# EAGLE schematic higheTemp (EAGLE 9.5.2)
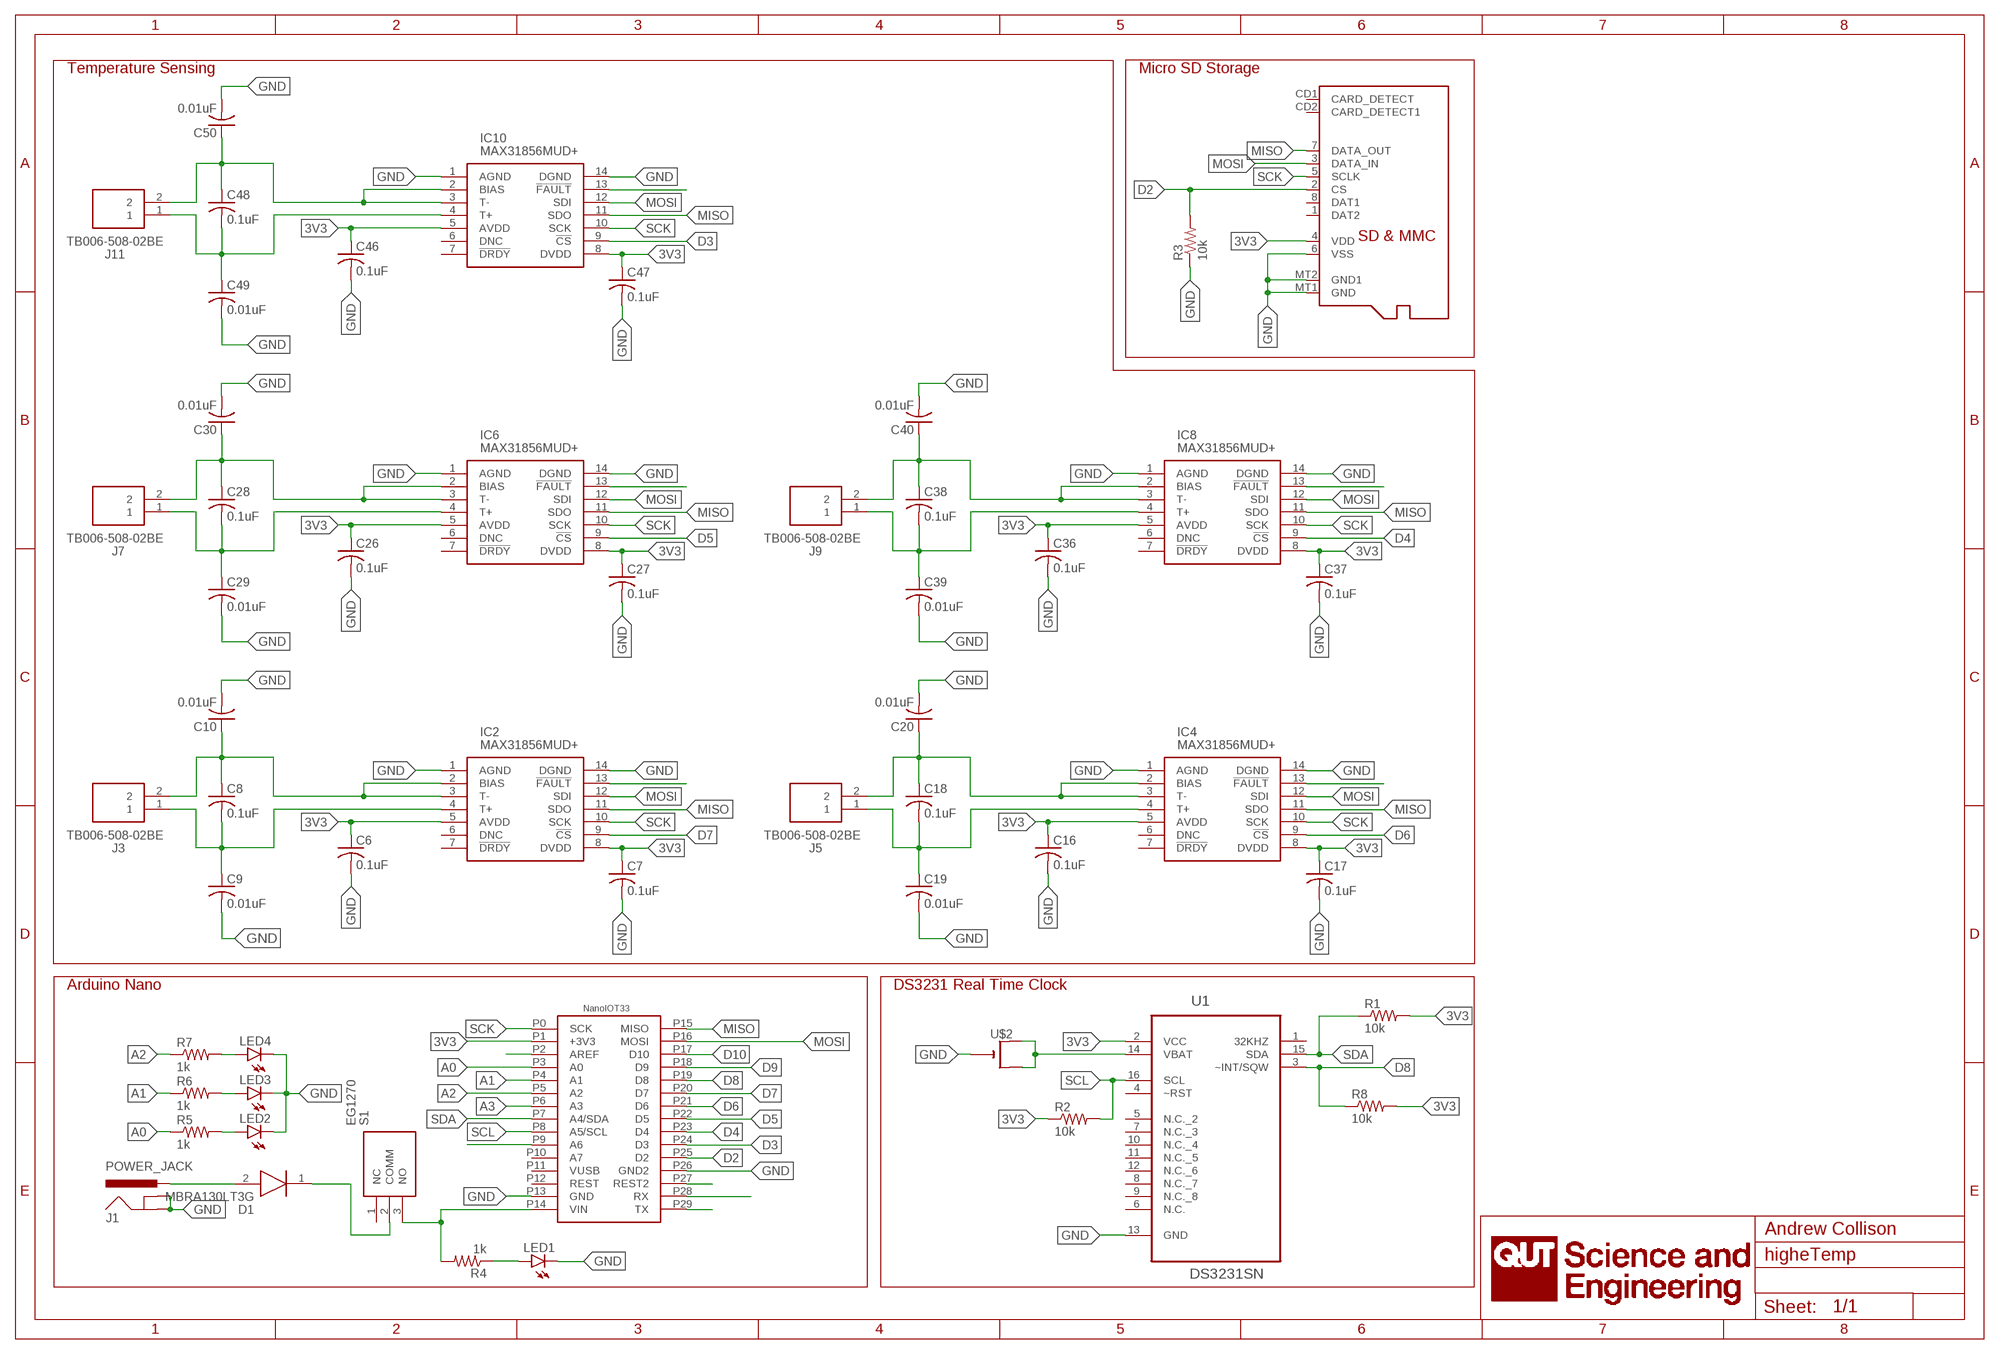
[diagram p0: schematic, sheet 1]

## Parts
C6  0.1uF  C-USC0603  [C0603]
C7  0.1uF  C-USC0603  [C0603]
C8  0.1uF  C-USC0603  [C0603]
C9  0.01uF  C-USC0603  [C0603]
C10  0.01uF  C-USC0603  [C0603]
C16  0.1uF  C-USC0603  [C0603]
C17  0.1uF  C-USC0603  [C0603]
C18  0.1uF  C-USC0603  [C0603]
C19  0.01uF  C-USC0603  [C0603]
C20  0.01uF  C-USC0603  [C0603]
C26  0.1uF  C-USC0603  [C0603]
C27  0.1uF  C-USC0603  [C0603]
C28  0.1uF  C-USC0603  [C0603]
C29  0.01uF  C-USC0603  [C0603]
C30  0.01uF  C-USC0603  [C0603]
C36  0.1uF  C-USC0603  [C0603]
C37  0.1uF  C-USC0603  [C0603]
C38  0.1uF  C-USC0603  [C0603]
C39  0.01uF  C-USC0603  [C0603]
C40  0.01uF  C-USC0603  [C0603]
C46  0.1uF  C-USC0603  [C0603]
C47  0.1uF  C-USC0603  [C0603]
C48  0.1uF  C-USC0603  [C0603]
C49  0.01uF  C-USC0603  [C0603]
C50  0.01uF  C-USC0603  [C0603]
D1  MBRA130LT3G  [DIOM5226X220N]
IC2  MAX31856MUD+  [SOP65P640X110-14N]
IC4  MAX31856MUD+  [SOP65P640X110-14N]
IC6  MAX31856MUD+  [SOP65P640X110-14N]
IC8  MAX31856MUD+  [SOP65P640X110-14N]
IC10  MAX31856MUD+  [SOP65P640X110-14N]
J1  POWER_JACK  [POWER_JACK_PTH]
J3  TB006-508-02BE  [TB00650802BE]
J5  TB006-508-02BE  [TB00650802BE]
J7  TB006-508-02BE  [TB00650802BE]
J9  TB006-508-02BE  [TB00650802BE]
J11  TB006-508-02BE  [TB00650802BE]
LED1  LEDCHIPLED_0805  [CHIPLED_0805]
LED2  LEDCHIPLED_0805  [CHIPLED_0805]
LED3  LEDCHIPLED_0805  [CHIPLED_0805]
LED4  LEDCHIPLED_0805  [CHIPLED_0805]
R1  10k  R-US_R0603  [R0603]
R2  10k  R-US_R0603  [R0603]
R3  10k  R-US_R0805  [R0805]
R4  1k  R-US_R0603  [R0603]
R5  1k  R-US_R0603  [R0603]
R6  1k  R-US_R0603  [R0603]
R7  1k  R-US_R0603  [R0603]
R8  10k  R-US_R0805  [R0805]
S1  EG1270  [EG1270]
U1  DS3231SN  [SOIC127P1032X265-16N]
U$1  NANO33IOT  [NANO33IOT]
U$2  CR1220SMT  [CR1220-SMD]
U$3  MICROSD  [MICROSD]

## Nets
3V3: C6.1 C7.1 C16.1 C17.1 C26.1 C27.1 C36.1 C37.1 C46.1 C47.1 IC2.5(AVDD) IC2.8(DVDD) IC4.5(AVDD) IC4.8(DVDD) IC6.5(AVDD) IC6.8(DVDD) IC8.5(AVDD) IC8.8(DVDD) IC10.5(AVDD) IC10.8(DVDD) R1.2 R2.1 R8.2 U1.2(VCC) U$1.P1(+3V3) U$3.4(VDD)
A0: R5.1 U$1.P3(A0)
A1: R6.1 U$1.P4(A1)
A2: R7.1 U$1.P5(A2)
A3: U$1.P6(A3)
D2: R3.2 U$1.P25(D2) U$3.2(CS)
D3: IC10.9(!CS) U$1.P24(D3)
D4: IC8.9(!CS) U$1.P23(D4)
D5: IC6.9(!CS) U$1.P22(D5)
D6: IC4.9(!CS) U$1.P21(D6)
D7: IC2.9(!CS) U$1.P20(D7)
D8: R8.1 U1.3(~INT/SQW) U$1.P19(D8)
D9: U$1.P18(D9)
D10: U$1.P17(D10)
GND: C6.2 C7.2 C9.2 C10.2 C16.2 C17.2 C19.2 C20.2 C26.2 C27.2 C29.2 C30.2 C36.2 C37.2 C39.2 C40.2 C46.2 C47.2 C49.2 C50.2 IC2.1(AGND) IC2.14(DGND) IC4.1(AGND) IC4.14(DGND) IC6.1(AGND) IC6.14(DGND) IC8.1(AGND) IC8.14(DGND) IC10.1(AGND) IC10.14(DGND) J1.GND J1.GNDBREAK LED1.C LED2.C LED3.C LED4.C R3.1 U1.13(GND) U$1.P13(GND) U$1.P26(GND2) U$2.- U$3.6(VSS) U$3.MT1(GND) U$3.MT2(GND1)
MISO: IC2.11(SDO) IC4.11(SDO) IC6.11(SDO) IC8.11(SDO) IC10.11(SDO) U$1.P15(MISO) U$3.7(DATA_OUT)
MOSI: IC2.12(SDI) IC4.12(SDI) IC6.12(SDI) IC8.12(SDI) IC10.12(SDI) U$1.P16(MOSI) U$3.3(DATA_IN)
N$1: U1.14(VBAT) U$2.+$1(+) U$2.+$2(+1)
N$2: D1.2(A) J1.PWR
N$3: U$1.P2(AREF)
N$4: LED1.A R4.1
N$6: D1.1(K) S1.2(COMM)
N$8: IC2.13(!FAULT)
N$10: R4.2 S1.3(NO) U$1.P14(VIN)
N$11: U$1.P9(A6)
N$12: IC4.13(!FAULT)
N$13: LED2.A R5.2
N$14: IC6.13(!FAULT)
N$16: IC8.13(!FAULT)
N$17: LED4.A R7.2
N$18: IC10.13(!FAULT)
N$20: U$1.P27(REST2)
N$21: U$1.P28(RX)
N$22: U$1.P29(TX)
N$26: LED3.A R6.2
SCK: IC2.10(SCK) IC4.10(SCK) IC6.10(SCK) IC8.10(SCK) IC10.10(SCK) U$1.P0(SCK) U$3.5(SCLK)
SCL: R2.2 U1.16(SCL) U$1.P8(A5/SCL)
SDA: R1.1 U1.15(SDA) U$1.P7(A4/SDA)
T1+1: C8.2 C9.1 IC2.4(T+) J3.1
T1+3: C18.2 C19.1 IC4.4(T+) J5.1
T1+5: C28.2 C29.1 IC6.4(T+) J7.1
T1+7: C38.2 C39.1 IC8.4(T+) J9.1
T1+9: C48.2 C49.1 IC10.4(T+) J11.1
T1-1: C8.1 C10.1 IC2.2(BIAS) IC2.3(T-) J3.2
T1-3: C18.1 C20.1 IC4.2(BIAS) IC4.3(T-) J5.2
T1-5: C28.1 C30.1 IC6.2(BIAS) IC6.3(T-) J7.2
T1-7: C38.1 C40.1 IC8.2(BIAS) IC8.3(T-) J9.2
T1-9: C48.1 C50.1 IC10.2(BIAS) IC10.3(T-) J11.2
Unconnected: IC2.6(DNC) IC2.7(!DRDY) IC4.6(DNC) IC4.7(!DRDY) IC6.6(DNC) IC6.7(!DRDY) IC8.6(DNC) IC8.7(!DRDY) IC10.6(DNC) IC10.7(!DRDY) S1.1(NC) U1.1(32KHZ) U1.4(~RST) U1.5(N.C._2) U1.6(N.C.) U1.7(N.C._3) U1.8(N.C._7) U1.9(N.C._8) U1.10(N.C._4) U1.11(N.C._5) U1.12(N.C._6) U$1.P10(A7) U$1.P11(VUSB) U$1.P12(REST) U$3.1(DAT2) U$3.8(DAT1) U$3.CD1(CARD_DETECT) U$3.CD2(CARD_DETECT1)

## Notes on the sheet
- Temperature Sensing | Micro SD Storage
- Arduino Nano | DS3231 Real Time Clock
- Andrew Collison

## Library data of the parts
C6-C10 C16-C20 C26-C30 C36-C40 C46-C50 = rcl:C-US: CAPACITOR, American symbol; SPICEPREFIX: C
D1 = SamacSys_Parts:MBRA130LT3G: Source: Datasheet <https://componentsearchengine.com/Datasheets/1/MBRA130LT3G.pdf>; HEIGHT: 2.2mm; MANUFACTURER_NAME: ON Semiconductor; MANUFACTURER_PART_NUMBER: MBRA130LT3G; MOUSER_PART_NUMBER: 863-MBRA130LT3G; MOUSER_PRICE-STOCK: https://www.mouser.com/Search/Refine.aspx?Keyword=863-MBRA130LT3G
IC2 IC4 IC6 IC8 IC10 = SamacSys_Parts:MAX31856MUD+: MAXIM INTEGRATED PRODUCTS - MAX31856MUD+ - TEMPERATURE SENSOR, 2DEG C, TSSOP-14 Source: Datasheet <https://componentsearchengine.com/Datasheets/1/MAX31856MUD .pdf>; DESCRIPTION: MAXIM INTEGRATED PRODUCTS - MAX31856MUD+ - TEMPERATURE SENSOR, 2DEG C, TSSOP-14; HEIGHT: 1.1mm; MANUFACTURER_NAME: Maxim Integrated; MANUFACTURER_PART_NUMBER: MAX31856MUD+; MOUSER_PART_NUMBER: 700-MAX31856MUD+; MOUSER_PRICE-STOCK: https://www.mouser.com/Search/Refine.aspx?Keyword=700-MAX31856MUD%2B
J1 = SparkFun-Connectors:POWER_JACK: Power Jack Connector This is the standard 5.5mm barrel jack for power. The PTH is the most common, proven, reliable, footprint. The Slot footprint only works if the mill layer is transmitted to the PCB fab house so be warned. Here are the connectors we sell at SparkFun: DC Barrel Power Jack/Connector <https://www.sparkfun.com/products/119> (PRT-00119) DC Barrel Power Jack/Connector (SMD) <https://www.sparkfun.com/products/12748> (PRT-12748) DC Barrel Jack Adapter - Breadboard Compatible <https://www.sparkfun.com/products/10811> (PRT-10811) It is used on this SparkFun product (and many, many others): SparkFun RedBoard - Programmed with Arduino <https://www.sparkfun.com/products/12757> (DEV-12757) Also, if you need a mating power supply or connector, please check these out: Wall Adapter Power Supply - 9VDC 650mA <https://www.sparkfun.com/products/298> (TOL-00298) DC Barrel Jack Adapter - Male <https://www.sparkfun.com/products/10287> (PRT-10287); PROD_ID: CONN-08197
J3 J5 J7 J9 J11 = SamacSys_Parts:TB006-508-02BE: Fixed Terminal Blocks screw type, 5.08 , horizontal, 2 poles, CUI Blue, slotted screw, PCB mount Source: Datasheet; DESCRIPTION: Fixed Terminal Blocks screw type, 5.08 , horizontal, 2 poles, CUI Blue, slotted screw, PCB mount; HEIGHT: 10.4mm; MANUFACTURER_NAME: CUI Devices; MANUFACTURER_PART_NUMBER: TB006-508-02BE; MOUSER_PART_NUMBER: 490-TB006-508-02BE; MOUSER_PRICE-STOCK: https://www.mouser.co.uk/ProductDetail/CUI-Devices/TB006-508-02BE?qs=vLWxofP3U2wEdOVV%2FaT04w%3D%3D
LED1-LED4 = led:LED: LED OSRAM: - CHIPLED LG R971, LG N971, LY N971, LG Q971, LY Q971, LO R971, LY R971 LH N974, LH R974 LS Q976, LO Q976, LY Q976 LO Q996 - Hyper CHIPLED LW Q18S LB Q993, LB Q99A, LB R99A - SideLED LS A670, LO A670, LY A670, LG A670, LP A670 LB A673, LV A673, LT A673, LW A673 LH A674 LY A675 LS A676, LA A676, LO A676, LY A676, LW A676 LS A679, LY A679, LG A679 - Hyper Micro SIDELED® LS Y876, LA Y876, LO Y876, LY Y876 LT Y87S - SmartLED LW L88C, LW L88S LB L89C, LB L89S, LG L890 LS L89K, LO L89K, LY L89K LS L896, LA L896, LO L896, LY L896 - TOPLED LS T670, LO T670, LY T670, LG T670, LP T670 LSG T670, LSP T670, LSY T670, LOP T670, LYG T670 LG T671, LOG T671, LSG T671 LB T673, LV T673, LT T673, LW T673 LH T674 LS T676, LA T676, LO T676, LY T676, LB T676, LH T676, LSB T676, LW T676 LB T67C, LV T67C, LT T67C, LS T67K, LO T67K, LY T67K, LW E67C LS E67B, LA E67B, LO E67B, LY E67B, LB E67C, LV E67C, LT E67C LW T67C LS T679, LY T679, LG T679 LS T770, LO T770, LY T770, LG T770, LP T770 LB T773, LV T773, LT T773, LW T773 LH T774 LS E675, LA E675, LY E675, LS T675 LS T776, LA T776, LO T776, LY T776, LB T776 LHGB T686 LT T68C, LB T68C - Hyper Mini TOPLED® LB M676 - Mini TOPLED Santana® LG M470 LS M47K, LO M47K, LY M47K Source: http://www.osram.convergy.de LUXEON: - LUMILED® LXK2-PW12-R00, LXK2-PW12-S00, LXK2-PW14-U00, LXK2-PW14-V00 LXK2-PM12-R00, LXK2-PM12-S00, LXK2-PM14-U00 LXK2-PE12-Q00, LXK2-PE12-R00, LXK2-PE12-S00, LXK2-PE14-T00, LXK2-PE14-U00 LXK2-PB12-K00, LXK2-PB12-L00, LXK2-PB12-M00, LXK2-PB14-N00, LXK2-PB14-P00, LXK2-PB14-Q00 LXK2-PR12-L00, LXK2-PR12-M00, LXK2-PR14-Q00, LXK2-PR14-R00 LXK2-PD12-Q00, LXK2-PD12-R00, LXK2-PD12-S00 LXK2-PH12-R00, LXK2-PH12-S00 LXK2-PL12-P00, LXK2-PL12-Q00, LXK2-PL12-R00 Source: www.luxeon.com KINGBRIGHT: KA-3528ASYC Source: www.kingbright.com
R1-R8 = rcl:R-US_: RESISTOR, American symbol; SPICEPREFIX: R
S1 = SamacSys_Parts:EG1270: E-SWITCH - EG1270 - SWITCH, SLIDE, SPDT, 300mA, 6V, PCB Source: Datasheet <https://componentsearchengine.com/Datasheets/1/EG1270.pdf>; DESCRIPTION: E-SWITCH - EG1270 - SWITCH, SLIDE, SPDT, 300mA, 6V, PCB; HEIGHT: 4.6mm; MANUFACTURER_NAME: E-Switch; MANUFACTURER_PART_NUMBER: EG1270; MOUSER_PART_NUMBER: 612-EG1270; MOUSER_PRICE-STOCK: https://www.mouser.co.uk/ProductDetail/E-Switch/EG1270?qs=xDsBkp9LkodMM2ilVTltow%3D%3D
U1 = Maxim_By_element14_Batch_1:DS3231SN: Extremely Accurate I2C-Integrated RTC/TCXO/Crystal; MPN: DS3231SN#; OC_FARNELL: 1593292; OC_NEWARK: 68K3406; PACKAGE: SOIC-16; SUPPLIER: Maxim
U$1 = AndrewFootprint:NANO33IOT
U$2 = adafruit:CR1220: CR1216/CR1220/CR1225 12mm 3V lithium coin cell Great for battery packup. Both SMT and THM holders. Note the THM package has the ground pads on both sides of the PCB so that the masks are the same - this reduces the cost
U$3 = adafruit:MICROSD: Micro-SD / Transflash card holder with SPI pinout For the 3M # 2908-05WB-MG and/or 4UCON #19656 push-push type